# Altium schematic sheet 00_map.SchDoc
size A
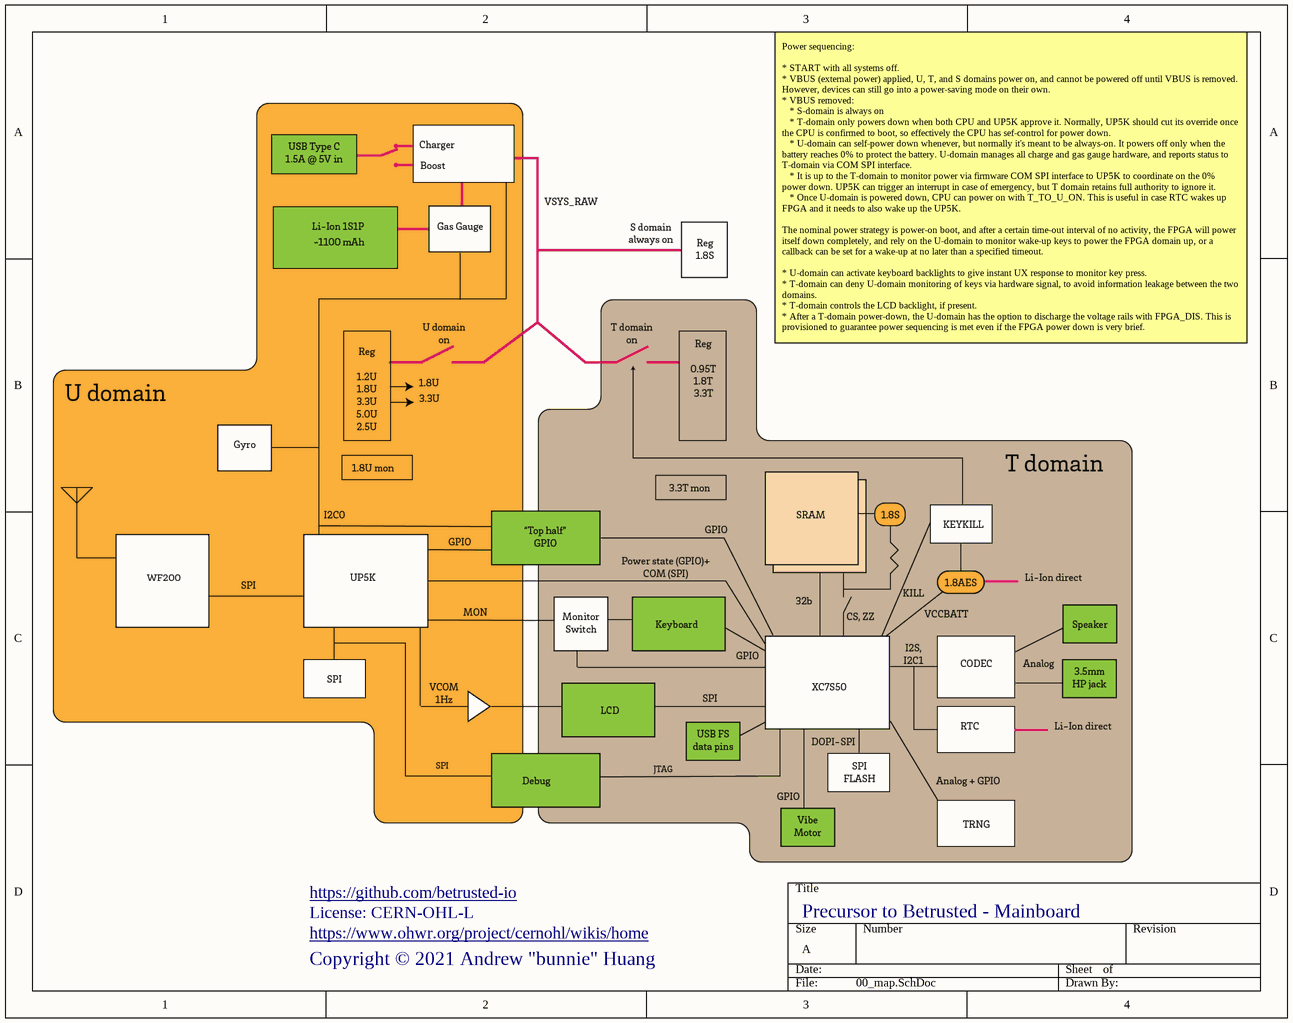
[diagram p0: 00_map.SchDoc]

## Notes on the sheet
- Power sequencing:
  * START with all systems off.
  * VBUS (external power) applied, U, T, and S domains power on, and cannot be powered off until VBUS is removed. However, devices can still go into a power-saving mode on their own.
  * VBUS removed:
  * S-domain is always on
  * T-domain only powers down when both CPU and UP5K approve it. Normally, UP5K should cut its override once the CPU is confirmed to boot, so effectively the CPU has sef-control for power down.
  * U-domain can self-power down whenever, but normally it's meant to be always-on. It powers off only when the battery reaches 0% to protect the battery. U-domain manages all charge and gas gauge hardware, and reports status to T-domain via COM SPI interface.
  * It is up to the T-domain to monitor power via firmware COM SPI interface to UP5K to coordinate on the 0% power down. UP5K can trigger an interrupt in case of emergency, but T domain retains full authority to ignore it.
  * Once U-domain is powered down, CPU can power on with T_TO_U_ON. This is useful in case RTC wakes up FPGA and it needs to also wake up the UP5K.
  The nominal power strategy is power-on boot, and after a certain time-out interval of no activity, the FPGA will power itself down completely, and rely on the U-domain to monitor wake-up keys to power the FPGA domain up, or a callback can be set for a wake-up at no later than a specified timeout.
  * U-domain can activate keyboard backlights to give instant UX response to monitor key press.
  * T-domain can deny U-domain monitoring of keys via hardware signal, to avoid information leakage between the two domains.
  * T-domain controls the LCD backlight, if present.
  * After a T-domain power-down, the U-domain has the option to discharge the voltage rails with FPGA_DIS. This is provisioned to guarantee power sequencing is met even if the FPGA power down is very brief.
- https://github.com/betrusted-io
- License: CERN-OHL-L
- Copyright © 2021 Andrew "bunnie" Huang
- https://www.ohwr.org/project/cernohl/wikis/home
- Precursor to Betrusted - Mainboard